# Altium schematic sheet FFT_IFFT.SchDoc
size A2
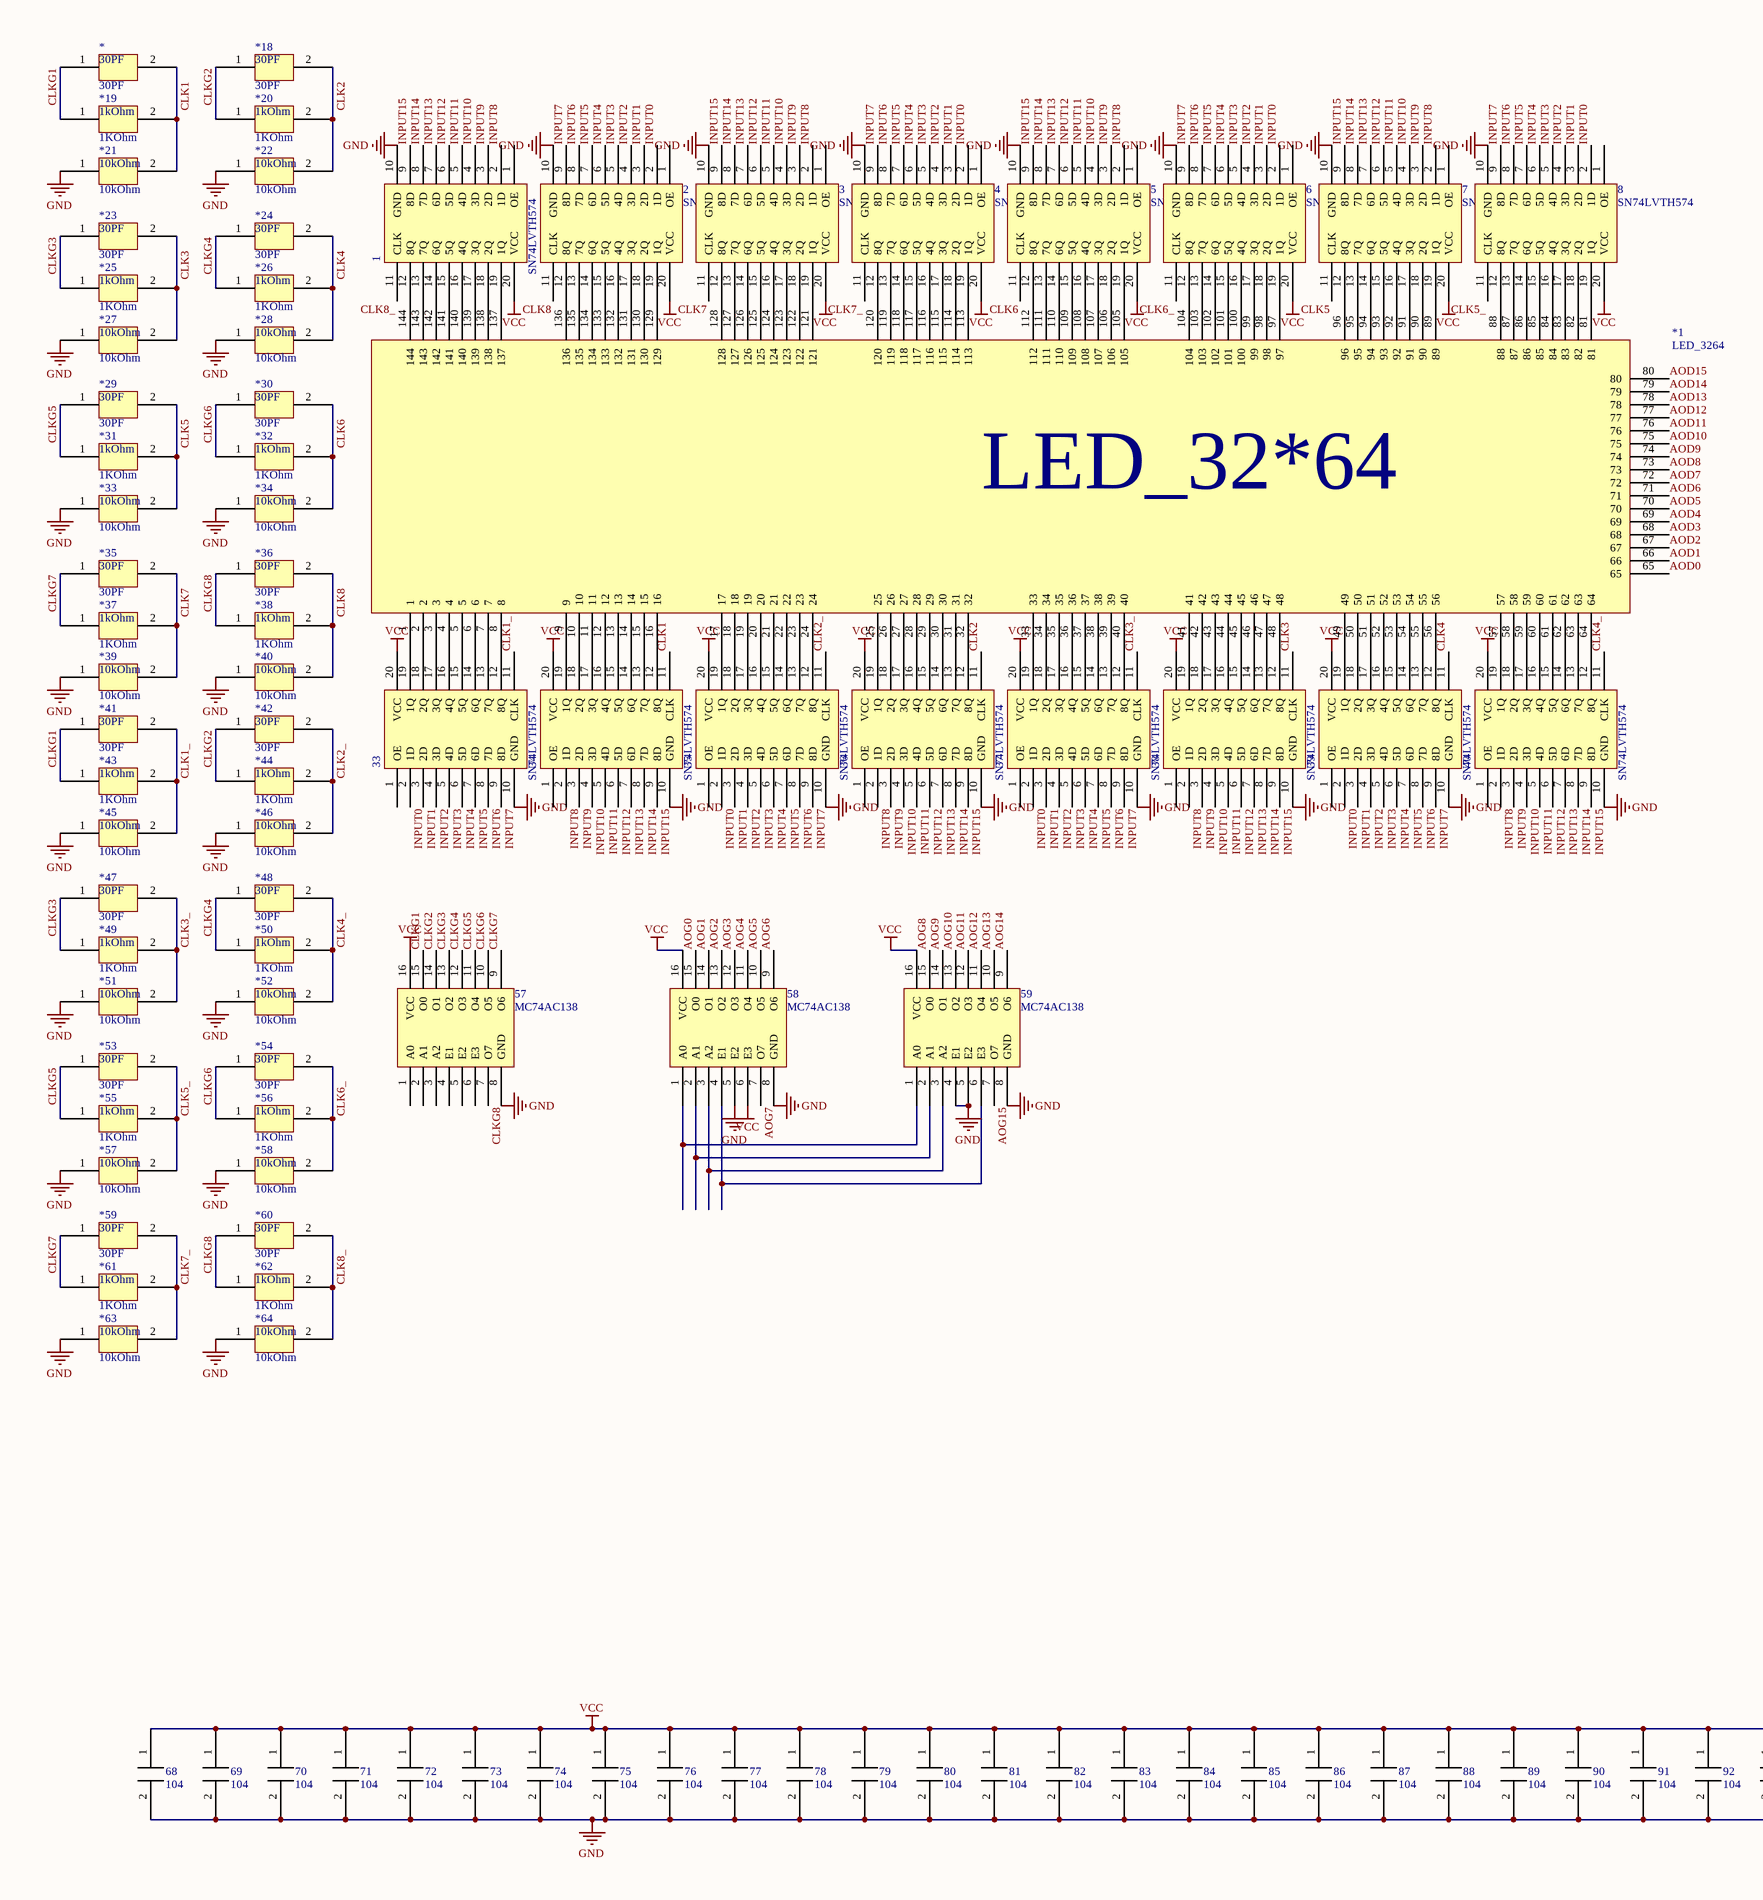
[diagram p0: FFT_IFFT.SchDoc, left]
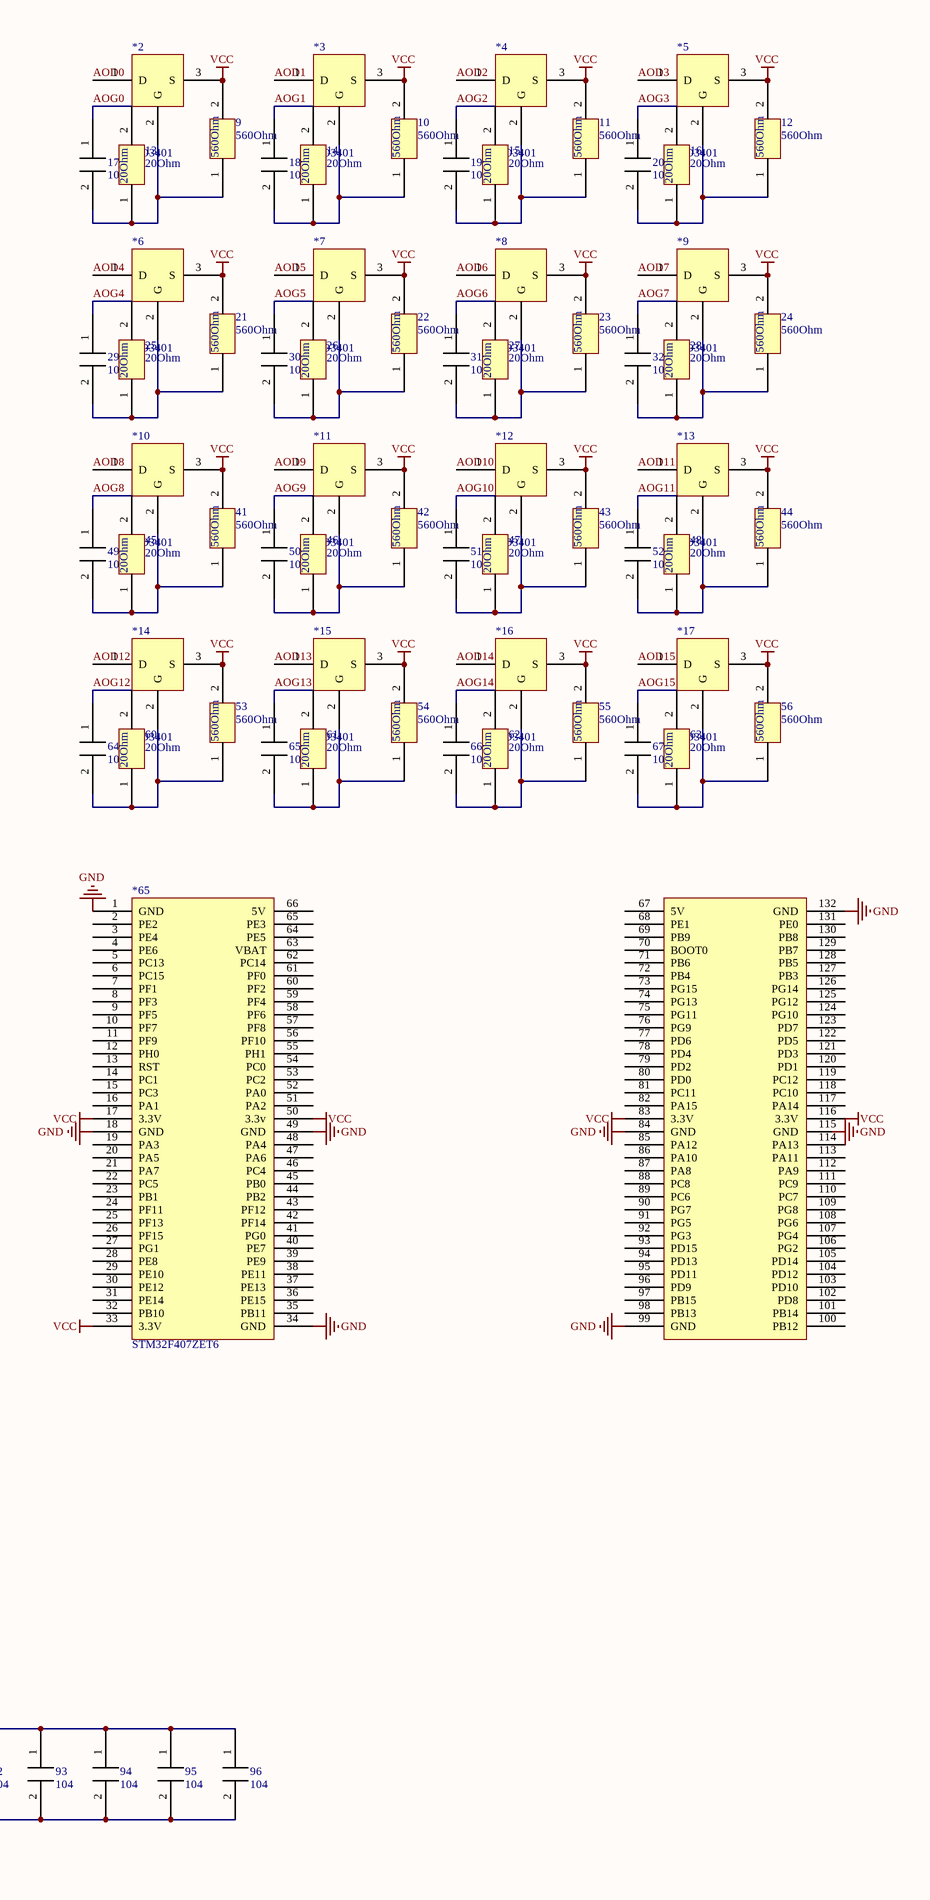
[diagram p1: FFT_IFFT.SchDoc, right]

## Parts
1  SN74LVTH574  [SN74LVTH574]
2  SN74LVTH574  [SN74LVTH574]
3  SN74LVTH574  [SN74LVTH574]
4  SN74LVTH574  [SN74LVTH574]
5  SN74LVTH574  [SN74LVTH574]
6  SN74LVTH574  [SN74LVTH574]
7  SN74LVTH574  [SN74LVTH574]
8  SN74LVTH574  [SN74LVTH574]
9  560Ohm  [104]
10  560Ohm  [104]
11  560Ohm  [104]
12  560Ohm  [104]
13  20Ohm  [104]
14  20Ohm  [104]
15  20Ohm  [104]
16  20Ohm  [104]
17  104  [104]
18  104  [104]
19  104  [104]
20  104  [104]
21  560Ohm  [104]
22  560Ohm  [104]
23  560Ohm  [104]
24  560Ohm  [104]
25  20Ohm  [104]
26  20Ohm  [104]
27  20Ohm  [104]
28  20Ohm  [104]
29  104  [104]
30  104  [104]
31  104  [104]
32  104  [104]
33  SN74LVTH574  [SN74LVTH574]
34  SN74LVTH574  [SN74LVTH574]
35  SN74LVTH574  [SN74LVTH574]
36  SN74LVTH574  [SN74LVTH574]
37  SN74LVTH574  [SN74LVTH574]
38  SN74LVTH574  [SN74LVTH574]
39  SN74LVTH574  [SN74LVTH574]
40  SN74LVTH574  [SN74LVTH574]
41  560Ohm  [104]
42  560Ohm  [104]
43  560Ohm  [104]
44  560Ohm  [104]
45  20Ohm  [104]
46  20Ohm  [104]
47  20Ohm  [104]
48  20Ohm  [104]
49  104  [104]
50  104  [104]
51  104  [104]
52  104  [104]
53  560Ohm  [104]
54  560Ohm  [104]
55  560Ohm  [104]
56  560Ohm  [104]
57  MC74AC138  [MC74AC138]
58  MC74AC138  [MC74AC138]
59  MC74AC138  [MC74AC138]
60  20Ohm  [104]
61  20Ohm  [104]
62  20Ohm  [104]
63  20Ohm  [104]
64  104  [104]
65  104  [104]
66  104  [104]
67  104  [104]
68  104  [104]
69  104  [104]
70  104  [104]
71  104  [104]
72  104  [104]
73  104  [104]
74  104  [104]
75  104  [104]
76  104  [104]
77  104  [104]
78  104  [104]
79  104  [104]
80  104  [104]
81  104  [104]
82  104  [104]
83  104  [104]
84  104  [104]
85  104  [104]
86  104  [104]
87  104  [104]
88  104  [104]
89  104  [104]
90  104  [104]
91  104  [104]
92  104  [104]
93  104  [104]
94  104  [104]
95  104  [104]
96  104  [104]
*  30PF  [104]
*1  LED_3264  [LED_3264]
*2  AO3401  [AO3401]
*3  AO3401  [AO3401]
*4  AO3401  [AO3401]
*5  AO3401  [AO3401]
*6  AO3401  [AO3401]
*7  AO3401  [AO3401]
*8  AO3401  [AO3401]
*9  AO3401  [AO3401]
*10  AO3401  [AO3401]
*11  AO3401  [AO3401]
*12  AO3401  [AO3401]
*13  AO3401  [AO3401]
*14  AO3401  [AO3401]
*15  AO3401  [AO3401]
*16  AO3401  [AO3401]
*17  AO3401  [AO3401]
*18  30PF  [104]
*19  1KOhm  [104]
*20  1KOhm  [104]
*21  10kOhm  [104]
*22  10kOhm  [104]
*23  30PF  [104]
*24  30PF  [104]
*25  1KOhm  [104]
*26  1KOhm  [104]
*27  10kOhm  [104]
*28  10kOhm  [104]
*29  30PF  [104]
*30  30PF  [104]
*31  1KOhm  [104]
*32  1KOhm  [104]
*33  10kOhm  [104]
*34  10kOhm  [104]
*35  30PF  [104]
*36  30PF  [104]
*37  1KOhm  [104]
*38  1KOhm  [104]
*39  10kOhm  [104]
*40  10kOhm  [104]
*41  30PF  [104]
*42  30PF  [104]
*43  1KOhm  [104]
*44  1KOhm  [104]
*45  10kOhm  [104]
*46  10kOhm  [104]
*47  30PF  [104]
*48  30PF  [104]
*49  1KOhm  [104]
*50  1KOhm  [104]
*51  10kOhm  [104]
*52  10kOhm  [104]
*53  30PF  [104]
*54  30PF  [104]
*55  1KOhm  [104]
*56  1KOhm  [104]
*57  10kOhm  [104]
*58  10kOhm  [104]
*59  30PF  [104]
*60  30PF  [104]
*61  1KOhm  [104]
*62  1KOhm  [104]
*63  10kOhm  [104]
*64  10kOhm  [104]
*65  STM32F407ZET6  [STM32F407ZET6]

## Nets
GND: 1.10(GND) 2.10(GND) 3.10(GND) 4.10(GND) 5.10(GND) 6.10(GND) 7.10(GND) 8.10(GND) 33.10(GND) 34.10(GND) 35.10(GND) 36.10(GND) 37.10(GND) 38.10(GND) 39.10(GND) 40.10(GND) 57.8(GND) 58.5(E2) 58.8(GND) 59.4(E1) 59.5(E2) 59.8(GND) 68.2 69.2 70.2 71.2 72.2 73.2 74.2 75.2 76.2 77.2 78.2 79.2 80.2 81.2 82.2 83.2 84.2 85.2 86.2 87.2 88.2 89.2 90.2 91.2 92.2 93.2 94.2 95.2 96.2 *21.1 *22.1 *27.1 *28.1 *33.1 *34.1 *39.1 *40.1 *45.1 *46.1 *51.1 *52.1 *57.1 *58.1 *63.1 *64.1 *65.1(GND) *65.18(GND) *65.34(GND) *65.49(GND) *65.84(GND) *65.99(GND) *65.132(GND)
VCC: 1.20(VCC) 2.20(VCC) 3.20(VCC) 4.20(VCC) 5.20(VCC) 6.20(VCC) 7.20(VCC) 8.20(VCC) 9.2 10.2 11.2 12.2 21.2 22.2 23.2 24.2 33.20(VCC) 34.20(VCC) 35.20(VCC) 36.20(VCC) 37.20(VCC) 38.20(VCC) 39.20(VCC) 40.20(VCC) 41.2 42.2 43.2 44.2 53.2 54.2 55.2 56.2 57.16(VCC) 58.6(E3) 58.16(VCC) 59.16(VCC) 68.1 69.1 70.1 71.1 72.1 73.1 74.1 75.1 76.1 77.1 78.1 79.1 80.1 81.1 82.1 83.1 84.1 85.1 86.1 87.1 88.1 89.1 90.1 91.1 92.1 93.1 94.1 95.1 96.1 *2.3(S) *3.3(S) *4.3(S) *5.3(S) *6.3(S) *7.3(S) *8.3(S) *9.3(S) *10.3(S) *11.3(S) *12.3(S) *13.3(S) *14.3(S) *15.3(S) *16.3(S) *17.3(S) *65.17(3.3V) *65.33(3.3V) *65.50(3.3v) *65.83(3.3V) *65.116(3.3V)
AOD0: *1.65 *2.1(D)
AOD1: *1.66 *3.1(D)
AOD2: *1.67 *4.1(D)
AOD3: *1.68 *5.1(D)
AOD4: *1.69 *6.1(D)
AOD5: *1.70 *7.1(D)
AOD6: *1.71 *8.1(D)
AOD7: *1.72 *9.1(D)
AOD8: *1.73 *10.1(D)
AOD9: *1.74 *11.1(D)
AOD10: *1.75 *12.1(D)
AOD11: *1.76 *13.1(D)
AOD12: *1.77 *14.1(D)
AOD13: *1.78 *15.1(D)
AOD14: *1.79 *16.1(D)
AOD15: *1.80 *17.1(D)
AOG0: 13.2 17.1 58.15(O0)
AOG1: 14.2 18.1 58.14(O1)
AOG2: 15.2 19.1 58.13(O2)
AOG3: 16.2 20.1 58.12(O3)
AOG4: 25.2 29.1 58.11(O4)
AOG5: 26.2 30.1 58.10(O5)
AOG6: 27.2 31.1 58.9(O6)
AOG7: 28.2 32.1 58.7(O7)
AOG8: 45.2 49.1 59.15(O0)
AOG9: 46.2 50.1 59.14(O1)
AOG10: 47.2 51.1 59.13(O2)
AOG11: 48.2 52.1 59.12(O3)
AOG12: 59.11(O4) 60.2 64.1
AOG13: 59.10(O5) 61.2 65.1
AOG14: 59.9(O6) 62.2 66.1
AOG15: 59.7(O7) 63.2 67.1
CLK1: 34.11(CLK) *.2 *19.2 *21.2
CLK1_: 33.11(CLK) *41.2 *43.2 *45.2
CLK2: 36.11(CLK) *18.2 *20.2 *22.2
CLK2_: 35.11(CLK) *42.2 *44.2 *46.2
CLK3: 38.11(CLK) *23.2 *25.2 *27.2
CLK3_: 37.11(CLK) *47.2 *49.2 *51.2
CLK4: 39.11(CLK) *24.2 *26.2 *28.2
CLK4_: 40.11(CLK) *48.2 *50.2 *52.2
CLK5: 7.11(CLK) *29.2 *31.2 *33.2
CLK5_: 8.11(CLK) *53.2 *55.2 *57.2
CLK6: 5.11(CLK) *30.2 *32.2 *34.2
CLK6_: 6.11(CLK) *54.2 *56.2 *58.2
CLK7: 3.11(CLK) *35.2 *37.2 *39.2
CLK7_: 4.11(CLK) *59.2 *61.2 *63.2
CLK8: 2.11(CLK) *36.2 *38.2 *40.2
CLK8_: 1.11(CLK) *60.2 *62.2 *64.2
CLKG1: 57.15(O0) *.1 *19.1 *41.1 *43.1
CLKG2: 57.14(O1) *18.1 *20.1 *42.1 *44.1
CLKG3: 57.13(O2) *23.1 *25.1 *47.1 *49.1
CLKG4: 57.12(O3) *24.1 *26.1 *48.1 *50.1
CLKG5: 57.11(O4) *29.1 *31.1 *53.1 *55.1
CLKG6: 57.10(O5) *30.1 *32.1 *54.1 *56.1
CLKG7: 57.9(O6) *35.1 *37.1 *59.1 *61.1
CLKG8: 57.7(O7) *36.1 *38.1 *60.1 *62.1
INPUT0: 2.2(1D) 4.2(1D) 6.2(1D) 8.2(1D) 33.2(1D) 35.2(1D) 37.2(1D) 39.2(1D)
INPUT1: 2.3(2D) 4.3(2D) 6.3(2D) 8.3(2D) 33.3(2D) 35.3(2D) 37.3(2D) 39.3(2D)
INPUT2: 2.4(3D) 4.4(3D) 6.4(3D) 8.4(3D) 33.4(3D) 35.4(3D) 37.4(3D) 39.4(3D)
INPUT3: 2.5(4D) 4.5(4D) 6.5(4D) 8.5(4D) 33.5(4D) 35.5(4D) 37.5(4D) 39.5(4D)
INPUT4: 2.6(5D) 4.6(5D) 6.6(5D) 8.6(5D) 33.6(5D) 35.6(5D) 37.6(5D) 39.6(5D)
INPUT5: 2.7(6D) 4.7(6D) 6.7(6D) 8.7(6D) 33.7(6D) 35.7(6D) 37.7(6D) 39.7(6D)
INPUT6: 2.8(7D) 4.8(7D) 6.8(7D) 8.8(7D) 33.8(7D) 35.8(7D) 37.8(7D) 39.8(7D)
INPUT7: 2.9(8D) 4.9(8D) 6.9(8D) 8.9(8D) 33.9(8D) 35.9(8D) 37.9(8D) 39.9(8D)
INPUT8: 1.2(1D) 3.2(1D) 5.2(1D) 7.2(1D) 34.2(1D) 36.2(1D) 38.2(1D) 40.2(1D)
INPUT9: 1.3(2D) 3.3(2D) 5.3(2D) 7.3(2D) 34.3(2D) 36.3(2D) 38.3(2D) 40.3(2D)
INPUT10: 1.4(3D) 3.4(3D) 5.4(3D) 7.4(3D) 34.4(3D) 36.4(3D) 38.4(3D) 40.4(3D)
INPUT11: 1.5(4D) 3.5(4D) 5.5(4D) 7.5(4D) 34.5(4D) 36.5(4D) 38.5(4D) 40.5(4D)
INPUT12: 1.6(5D) 3.6(5D) 5.6(5D) 7.6(5D) 34.6(5D) 36.6(5D) 38.6(5D) 40.6(5D)
INPUT13: 1.7(6D) 3.7(6D) 5.7(6D) 7.7(6D) 34.7(6D) 36.7(6D) 38.7(6D) 40.7(6D)
INPUT14: 1.8(7D) 3.8(7D) 5.8(7D) 7.8(7D) 34.8(7D) 36.8(7D) 38.8(7D) 40.8(7D)
INPUT15: 1.9(8D) 3.9(8D) 5.9(8D) 7.9(8D) 34.9(8D) 36.9(8D) 38.9(8D) 40.9(8D)
Net1_12: 1.12(8Q) *1.144
Net1_13: 1.13(7Q) *1.143
Net1_14: 1.14(6Q) *1.142
Net1_15: 1.15(5Q) *1.141
Net1_16: 1.16(4Q) *1.140
Net1_17: 1.17(3Q) *1.139
Net1_18: 1.18(2Q) *1.138
Net1_19: 1.19(1Q) *1.137
Net2_12: 2.12(8Q) *1.136
Net2_13: 2.13(7Q) *1.135
Net2_14: 2.14(6Q) *1.134
Net2_15: 2.15(5Q) *1.133
Net2_16: 2.16(4Q) *1.132
Net2_17: 2.17(3Q) *1.131
Net2_18: 2.18(2Q) *1.130
Net2_19: 2.19(1Q) *1.129
Net3_12: 3.12(8Q) *1.128
Net3_13: 3.13(7Q) *1.127
Net3_14: 3.14(6Q) *1.126
Net3_15: 3.15(5Q) *1.125
Net3_16: 3.16(4Q) *1.124
Net3_17: 3.17(3Q) *1.123
Net3_18: 3.18(2Q) *1.122
Net3_19: 3.19(1Q) *1.121
Net4_12: 4.12(8Q) *1.120
Net4_13: 4.13(7Q) *1.119
Net4_14: 4.14(6Q) *1.118
Net4_15: 4.15(5Q) *1.117
Net4_16: 4.16(4Q) *1.116
Net4_17: 4.17(3Q) *1.115
Net4_18: 4.18(2Q) *1.114
Net4_19: 4.19(1Q) *1.113
Net5_12: 5.12(8Q) *1.112
Net5_13: 5.13(7Q) *1.111
Net5_14: 5.14(6Q) *1.110
Net5_15: 5.15(5Q) *1.109
Net5_16: 5.16(4Q) *1.108
Net5_17: 5.17(3Q) *1.107
Net5_18: 5.18(2Q) *1.106
Net5_19: 5.19(1Q) *1.105
Net6_12: 6.12(8Q) *1.104
Net6_13: 6.13(7Q) *1.103
Net6_14: 6.14(6Q) *1.102
Net6_15: 6.15(5Q) *1.101
Net6_16: 6.16(4Q) *1.100
Net6_17: 6.17(3Q) *1.99
Net6_18: 6.18(2Q) *1.98
Net6_19: 6.19(1Q) *1.97
Net7_12: 7.12(8Q) *1.96
Net7_13: 7.13(7Q) *1.95
Net7_14: 7.14(6Q) *1.94
Net7_15: 7.15(5Q) *1.93
Net7_16: 7.16(4Q) *1.92
Net7_17: 7.17(3Q) *1.91
Net7_18: 7.18(2Q) *1.90
Net7_19: 7.19(1Q) *1.89
Net8_12: 8.12(8Q) *1.88
Net8_13: 8.13(7Q) *1.87
Net8_14: 8.14(6Q) *1.86
Net8_15: 8.15(5Q) *1.85
Net8_16: 8.16(4Q) *1.84
Net8_17: 8.17(3Q) *1.83
Net8_18: 8.18(2Q) *1.82
Net8_19: 8.19(1Q) *1.81
Net9_1: 9.1 13.1 17.2 *2.2(G)
Net10_1: 10.1 14.1 18.2 *3.2(G)
Net11_1: 11.1 15.1 19.2 *4.2(G)
Net12_1: 12.1 16.1 20.2 *5.2(G)
Net21_1: 21.1 25.1 29.2 *6.2(G)
Net22_1: 22.1 26.1 30.2 *7.2(G)
Net23_1: 23.1 27.1 31.2 *8.2(G)
Net24_1: 24.1 28.1 32.2 *9.2(G)
Net33_12: 33.12(8Q) *1.8
Net33_13: 33.13(7Q) *1.7
Net33_14: 33.14(6Q) *1.6
Net33_15: 33.15(5Q) *1.5
Net33_16: 33.16(4Q) *1.4
Net33_17: 33.17(3Q) *1.3
Net33_18: 33.18(2Q) *1.2
Net33_19: 33.19(1Q) *1.1
Net34_12: 34.12(8Q) *1.16
Net34_13: 34.13(7Q) *1.15
Net34_14: 34.14(6Q) *1.14
Net34_15: 34.15(5Q) *1.13
Net34_16: 34.16(4Q) *1.12
Net34_17: 34.17(3Q) *1.11
Net34_18: 34.18(2Q) *1.10
Net34_19: 34.19(1Q) *1.9
Net35_12: 35.12(8Q) *1.24
Net35_13: 35.13(7Q) *1.23
Net35_14: 35.14(6Q) *1.22
Net35_15: 35.15(5Q) *1.21
Net35_16: 35.16(4Q) *1.20
Net35_17: 35.17(3Q) *1.19
Net35_18: 35.18(2Q) *1.18
Net35_19: 35.19(1Q) *1.17
Net36_12: 36.12(8Q) *1.32
Net36_13: 36.13(7Q) *1.31
Net36_14: 36.14(6Q) *1.30
Net36_15: 36.15(5Q) *1.29
Net36_16: 36.16(4Q) *1.28
Net36_17: 36.17(3Q) *1.27
Net36_18: 36.18(2Q) *1.26
Net36_19: 36.19(1Q) *1.25
Net37_12: 37.12(8Q) *1.40
Net37_13: 37.13(7Q) *1.39
Net37_14: 37.14(6Q) *1.38
Net37_15: 37.15(5Q) *1.37
Net37_16: 37.16(4Q) *1.36
Net37_17: 37.17(3Q) *1.35
Net37_18: 37.18(2Q) *1.34
Net37_19: 37.19(1Q) *1.33
Net38_12: 38.12(8Q) *1.48
Net38_13: 38.13(7Q) *1.47
Net38_14: 38.14(6Q) *1.46
Net38_15: 38.15(5Q) *1.45
Net38_16: 38.16(4Q) *1.44
Net38_17: 38.17(3Q) *1.43
Net38_18: 38.18(2Q) *1.42
Net38_19: 38.19(1Q) *1.41
Net39_12: 39.12(8Q) *1.56
Net39_13: 39.13(7Q) *1.55
Net39_14: 39.14(6Q) *1.54
Net39_15: 39.15(5Q) *1.53
Net39_16: 39.16(4Q) *1.52
Net39_17: 39.17(3Q) *1.51
Net39_18: 39.18(2Q) *1.50
Net39_19: 39.19(1Q) *1.49
Net40_12: 40.12(8Q) *1.64
Net40_13: 40.13(7Q) *1.63
Net40_14: 40.14(6Q) *1.62
Net40_15: 40.15(5Q) *1.61
Net40_16: 40.16(4Q) *1.60
Net40_17: 40.17(3Q) *1.59
Net40_18: 40.18(2Q) *1.58
Net40_19: 40.19(1Q) *1.57
Net41_1: 41.1 45.1 49.2 *10.2(G)
Net42_1: 42.1 46.1 50.2 *11.2(G)
Net43_1: 43.1 47.1 51.2 *12.2(G)
Net44_1: 44.1 48.1 52.2 *13.2(G)
Net53_1: 53.1 60.1 64.2 *14.2(G)
Net54_1: 54.1 61.1 65.2 *15.2(G)
Net55_1: 55.1 62.1 66.2 *16.2(G)
Net56_1: 56.1 63.1 67.2 *17.2(G)
Net58_1: 58.1(A0) 59.1(A0)
Net58_2: 58.2(A1) 59.2(A1)
Net58_3: 58.3(A2) 59.3(A2)
Net58_4: 58.4(E1) 59.6(E3)

Not connected (* = marked no-connect by the designer): 1 1(OE); 2 1(OE); 3 1(OE); 4 1(OE); 5 1(OE); 6 1(OE); 7 1(OE); 8 1(OE); 33 1(OE); 34 1(OE); 35 1(OE); 36 1(OE); 37 1(OE); 38 1(OE); 39 1(OE); 40 1(OE); 57 1(A0) 2(A1) 3(A2) 4(E1) 5(E2) 6(E3); *65 2(PE2) 3(PE4) 4(PE6) 5(PC13) 6(PC15) 7(PF1) 8(PF3) 9(PF5) 10(PF7) 11(PF9) 12(PH0) 13(RST) 14(PC1) 15(PC3) 16(PA1) 19(PA3) 20(PA5) 21(PA7) 22(PC5) 23(PB1) 24(PF11) 25(PF13) 26(PF15) 27(PG1) 28(PE8) 29(PE10) 30(PE12) 31(PE14) 32(PB10) 35(PB11) 36(PE15) 37(PE13) 38(PE11) 39(PE9) 40(PE7) 41(PG0) 42(PF14) 43(PF12) 44(PB2) 45(PB0) 46(PC4) 47(PA6) 48(PA4) 51(PA2) 52(PA0) 53(PC2) 54(PC0) 55(PH1) 56(PF10) 57(PF8) 58(PF6) 59(PF4) 60(PF2) 61(PF0) 62(PC14) 63(VBAT) 64(PE5) 65(PE3) 66(5V) 67(5V) 68(PE1) 69(PB9) 70(BOOT0) 71(PB6) 72(PB4) 73(PG15) 74(PG13) 75(PG11) 76(PG9) 77(PD6) 78(PD4) 79(PD2) 80(PD0) 81(PC11) 82(PA15) 85(PA12) 86(PA10) 87(PA8) 88(PC8) 89(PC6) 90(PG7) 91(PG5) 92(PG3) 93(PD15) 94(PD13) 95(PD11) 96(PD9) 97(PB15) 98(PB13) 100(PB12) 101(PB14) 102(PD8) 103(PD10) 104(PD12) 105(PD14) 106(PG2) 107(PG4) 108(PG6) 109(PG8) 110(PC7) 111(PC9) 112(PA9) 113(PA11) 114(PA13) 115(GND) 117(PA14) 118(PC10) 119(PC12) 120(PD1) 121(PD3) 122(PD5) 123(PD7) 124(PG10) 125(PG12) 126(PG14) 127(PB3) 128(PB5) 129(PB7) 130(PB8) 131(PE0)

## Notes on the sheet
- Labels drawn without touching a wire or pin: GND
- (in symbol 1KOhm) 1kOhm
- (in symbol LED_3264) LED_32*64